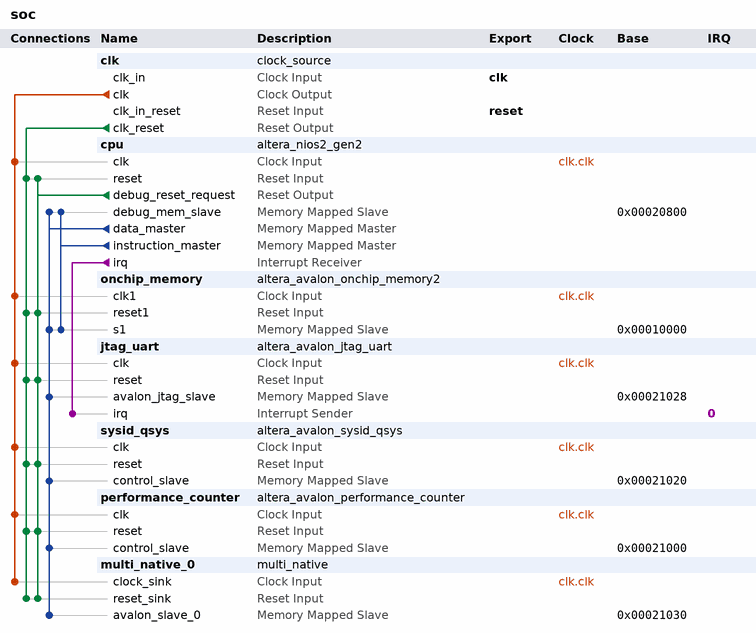
[diagram p0: system contents]
# Platform Designer (Qsys) system soc, MAX 10 10M50DAF484C7G
# Parameters at their usual value, and those the tool derives, are not listed.
package require -exact qsys 21.1
create_system soc
set_project_property DEVICE_FAMILY {MAX 10}
set_project_property DEVICE 10M50DAF484C7G

add_instance clk clock_source 21.1
set_instance_parameter_value clk clockFrequency 50000000

add_instance cpu altera_nios2_gen2 21.1
set_instance_parameter_value cpu dcache_size 2048
set_instance_parameter_value cpu exceptionSlave onchip_memory.s1
set_instance_parameter_value cpu icache_size 4096
set_instance_parameter_value cpu impl Tiny
set_instance_parameter_value cpu resetSlave onchip_memory.s1

add_instance onchip_memory altera_avalon_onchip_memory2 21.1
set_instance_parameter_value onchip_memory dataWidth 32
set_instance_parameter_value onchip_memory dualPort false
set_instance_parameter_value onchip_memory initMemContent false
set_instance_parameter_value onchip_memory initializationFileName onchip_mem.hex
set_instance_parameter_value onchip_memory memorySize 65536

add_instance jtag_uart altera_avalon_jtag_uart 21.1
set_instance_parameter_value jtag_uart simInteractiveOptions NO_INTERACTIVE_WINDOWS

add_instance sysid_qsys altera_avalon_sysid_qsys 21.1
set_instance_parameter_value sysid_qsys id 0

add_instance performance_counter altera_avalon_performance_counter 21.1
set_instance_parameter_value performance_counter numberOfSections 1

add_instance multi_native_0 multi_native 1.0

# connections
add_connection clk.clk cpu.clk clock
add_connection clk.clk jtag_uart.clk clock
add_connection clk.clk multi_native_0.clock_sink clock
add_connection clk.clk onchip_memory.clk1 clock
add_connection clk.clk performance_counter.clk clock
add_connection clk.clk sysid_qsys.clk clock
add_connection clk.clk_reset cpu.reset reset
add_connection clk.clk_reset jtag_uart.reset reset
add_connection clk.clk_reset multi_native_0.reset_sink reset
add_connection clk.clk_reset onchip_memory.reset1 reset
add_connection clk.clk_reset performance_counter.reset reset
add_connection clk.clk_reset sysid_qsys.reset reset
add_connection cpu.debug_reset_request cpu.reset reset
add_connection cpu.debug_reset_request jtag_uart.reset reset
add_connection cpu.debug_reset_request multi_native_0.reset_sink reset
add_connection cpu.debug_reset_request onchip_memory.reset1 reset
add_connection cpu.debug_reset_request performance_counter.reset reset
add_connection cpu.debug_reset_request sysid_qsys.reset reset
add_connection cpu.data_master cpu.debug_mem_slave avalon
set_connection_parameter_value cpu.data_master/cpu.debug_mem_slave baseAddress 0x00020800
add_connection cpu.data_master jtag_uart.avalon_jtag_slave avalon
set_connection_parameter_value cpu.data_master/jtag_uart.avalon_jtag_slave baseAddress 0x00021028
add_connection cpu.data_master multi_native_0.avalon_slave_0 avalon
set_connection_parameter_value cpu.data_master/multi_native_0.avalon_slave_0 baseAddress 0x00021030
add_connection cpu.data_master onchip_memory.s1 avalon
set_connection_parameter_value cpu.data_master/onchip_memory.s1 baseAddress 0x00010000
add_connection cpu.data_master performance_counter.control_slave avalon
set_connection_parameter_value cpu.data_master/performance_counter.control_slave baseAddress 0x00021000
add_connection cpu.data_master sysid_qsys.control_slave avalon
set_connection_parameter_value cpu.data_master/sysid_qsys.control_slave baseAddress 0x00021020
add_connection cpu.instruction_master cpu.debug_mem_slave avalon
set_connection_parameter_value cpu.instruction_master/cpu.debug_mem_slave baseAddress 0x00020800
add_connection cpu.instruction_master onchip_memory.s1 avalon
set_connection_parameter_value cpu.instruction_master/onchip_memory.s1 baseAddress 0x00010000
add_connection cpu.irq jtag_uart.irq interrupt
set_connection_parameter_value cpu.irq/jtag_uart.irq irqNumber 0

# exported interfaces
add_interface clk clock sink
set_interface_property clk EXPORT_OF clk.clk_in
add_interface reset reset sink
set_interface_property reset EXPORT_OF clk.clk_in_reset

set_interconnect_requirement {$system} qsys_mm.clockCrossingAdapter HANDSHAKE
set_interconnect_requirement {$system} qsys_mm.enableEccProtection FALSE
set_interconnect_requirement {$system} qsys_mm.insertDefaultSlave FALSE
set_interconnect_requirement {$system} qsys_mm.maxAdditionalLatency 1

save_system soc.qsys
